# EAGLE design mp34dt05 (EAGLE 9.2.0)
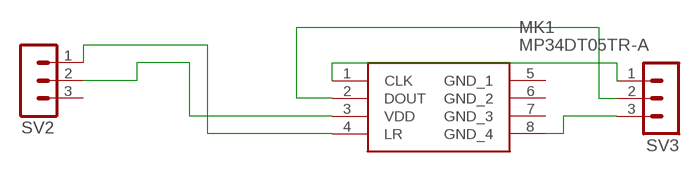
[diagram p0: schematic, sheet 1]

## Parts
MK1  MP34DT05TR-A  [MP34DT05TRA]
SV2  MA03-1  [MA03-1]
SV3  MA03-1  [MA03-1]

## Nets
N$1: MK1.4(LR) SV2.1
N$2: MK1.3(VDD) SV2.2
N$3: MK1.1(CLK) SV3.1
N$4: MK1.2(DOUT) SV3.2
N$5: MK1.8(GND_4) SV3.3
Unconnected: MK1.5(GND_1) MK1.6(GND_2) MK1.7(GND_3) SV2.3

## Library data of the parts
MK1 = MP34DT05TR-A:MP34DT05TR-A: STMICROELECTRONICS - MP34DT05TR-A - MEMS MICROPHONE, 3.6V, HCLGA-4 Source: Datasheet <http://www.st.com/content/ccc/resource/technical/document/datasheet/group3/c7/90/d3/f6/b7/e7/40/c8/DM00415595/files/DM00415595.pdf/jcr:content/translations/en.DM00415595.pdf>; DESCRIPTION: STMICROELECTRONICS - MP34DT05TR-A - MEMS MICROPHONE, 3.6V, HCLGA-4; HEIGHT: 1mm; MANUFACTURER_NAME: STMicroelectronics; MANUFACTURER_PART_NUMBER: MP34DT05TR-A; MOUSER_PART_NUMBER: 511-MP34DT05TR-A; MOUSER_PRICE-STOCK: https://www.mouser.com/Search/Refine.aspx?Keyword=511-MP34DT05TR-A
SV2 SV3 = con-lstb:MA03-1: PIN HEADER; OC_FARNELL: unknown; OC_NEWARK: unknown

## Board
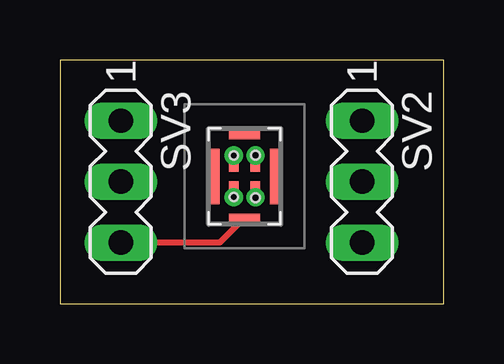
[diagram p1: board, top side]
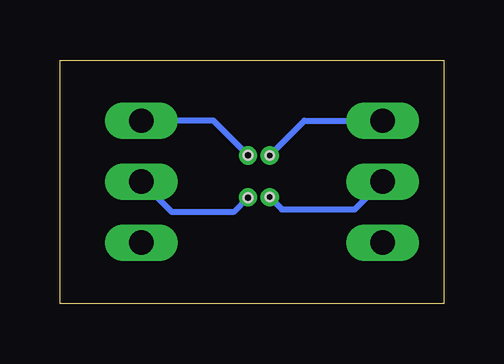
[diagram p2: board, bottom side, seen from below]

Size 16 x 10.15 mm. Coordinates in mm from the lower left corner, seen from the top.
Outline: 0,0 16,0 16,10.15 0,10.15 0,0
Copper layers (1*16): Top 0.035mm / dielectric 1.5mm / Bottom 0.035mm
Design rules "default": minimum track width 6mil, minimum drill 0.35mm, track to track 6mil, track to pad 6mil, pad to pad 6mil, via to via 6mil, smd to smd 6mil, copper to edge 40mil, drill to drill 6mil, minimum pad ring 10mil, minimum via ring 8mil, stop-mask expansion 4mil, vias tented up to drill 0mil, thermal gap 10mil
Holes 0.35 mm at 7.25,6.17 8.15,6.18 7.25,4.44 8.15,4.41

### Footprints (pad centres in the part's own frame; a part is rotated, then mirrored left to right if it is on the bottom)
MP34DT05TRA = smd 0.4 x 0.95: 1 -0.45,0.675; 2 -0.45,-0.675; 3 0.45,-0.675; 4 0.45,0.675 | smd 0.35 x 2.3: 5 -1.225,0; 6 1.225,0 | smd 1.3 x 0.35: 7 0,1.725; 8 0,-1.725
MA03-1 = drill 1.016 long: 1 -2.54,0; 2 0,0; 3 2.54,0

### Placement (x,y rotation side)
MK1  7.7,5.3 0 top
SV2  12.6,5.08 270 top
SV3  2.54,5.08 270 top

### Tracks (layer width: path | path; a pad name or v marks a point on that pad's centre or on a via)
N$1  (via drill 0.35)
  Top 0.152: MK1.4 v8.15,6.17
  Bottom 0.254: v8.15,6.17 9.6,7.62 SV2.1
N$2  (via drill 0.35)
  Top 0.152: MK1.3 v8.15,4.43
  Bottom 0.254: v8.15,4.43 8.77,3.81 11.33,3.81 SV2.2
N$3  (via drill 0.35)
  Top 0.152: MK1.1 v7.25,6.17
  Bottom 0.254: v7.25,6.17 5.8,7.62 SV3.1
N$4  (via drill 0.35)
  Top 0.152: MK1.2 v7.25,4.43
  Bottom 0.254: v7.25,4.43 6.75,3.92 3.7,3.92 SV3.2
N$5
  Top 0.254: MK1.8 6.67,2.54 SV3.3